# Altium project LetGetThingDone.PrjPcb
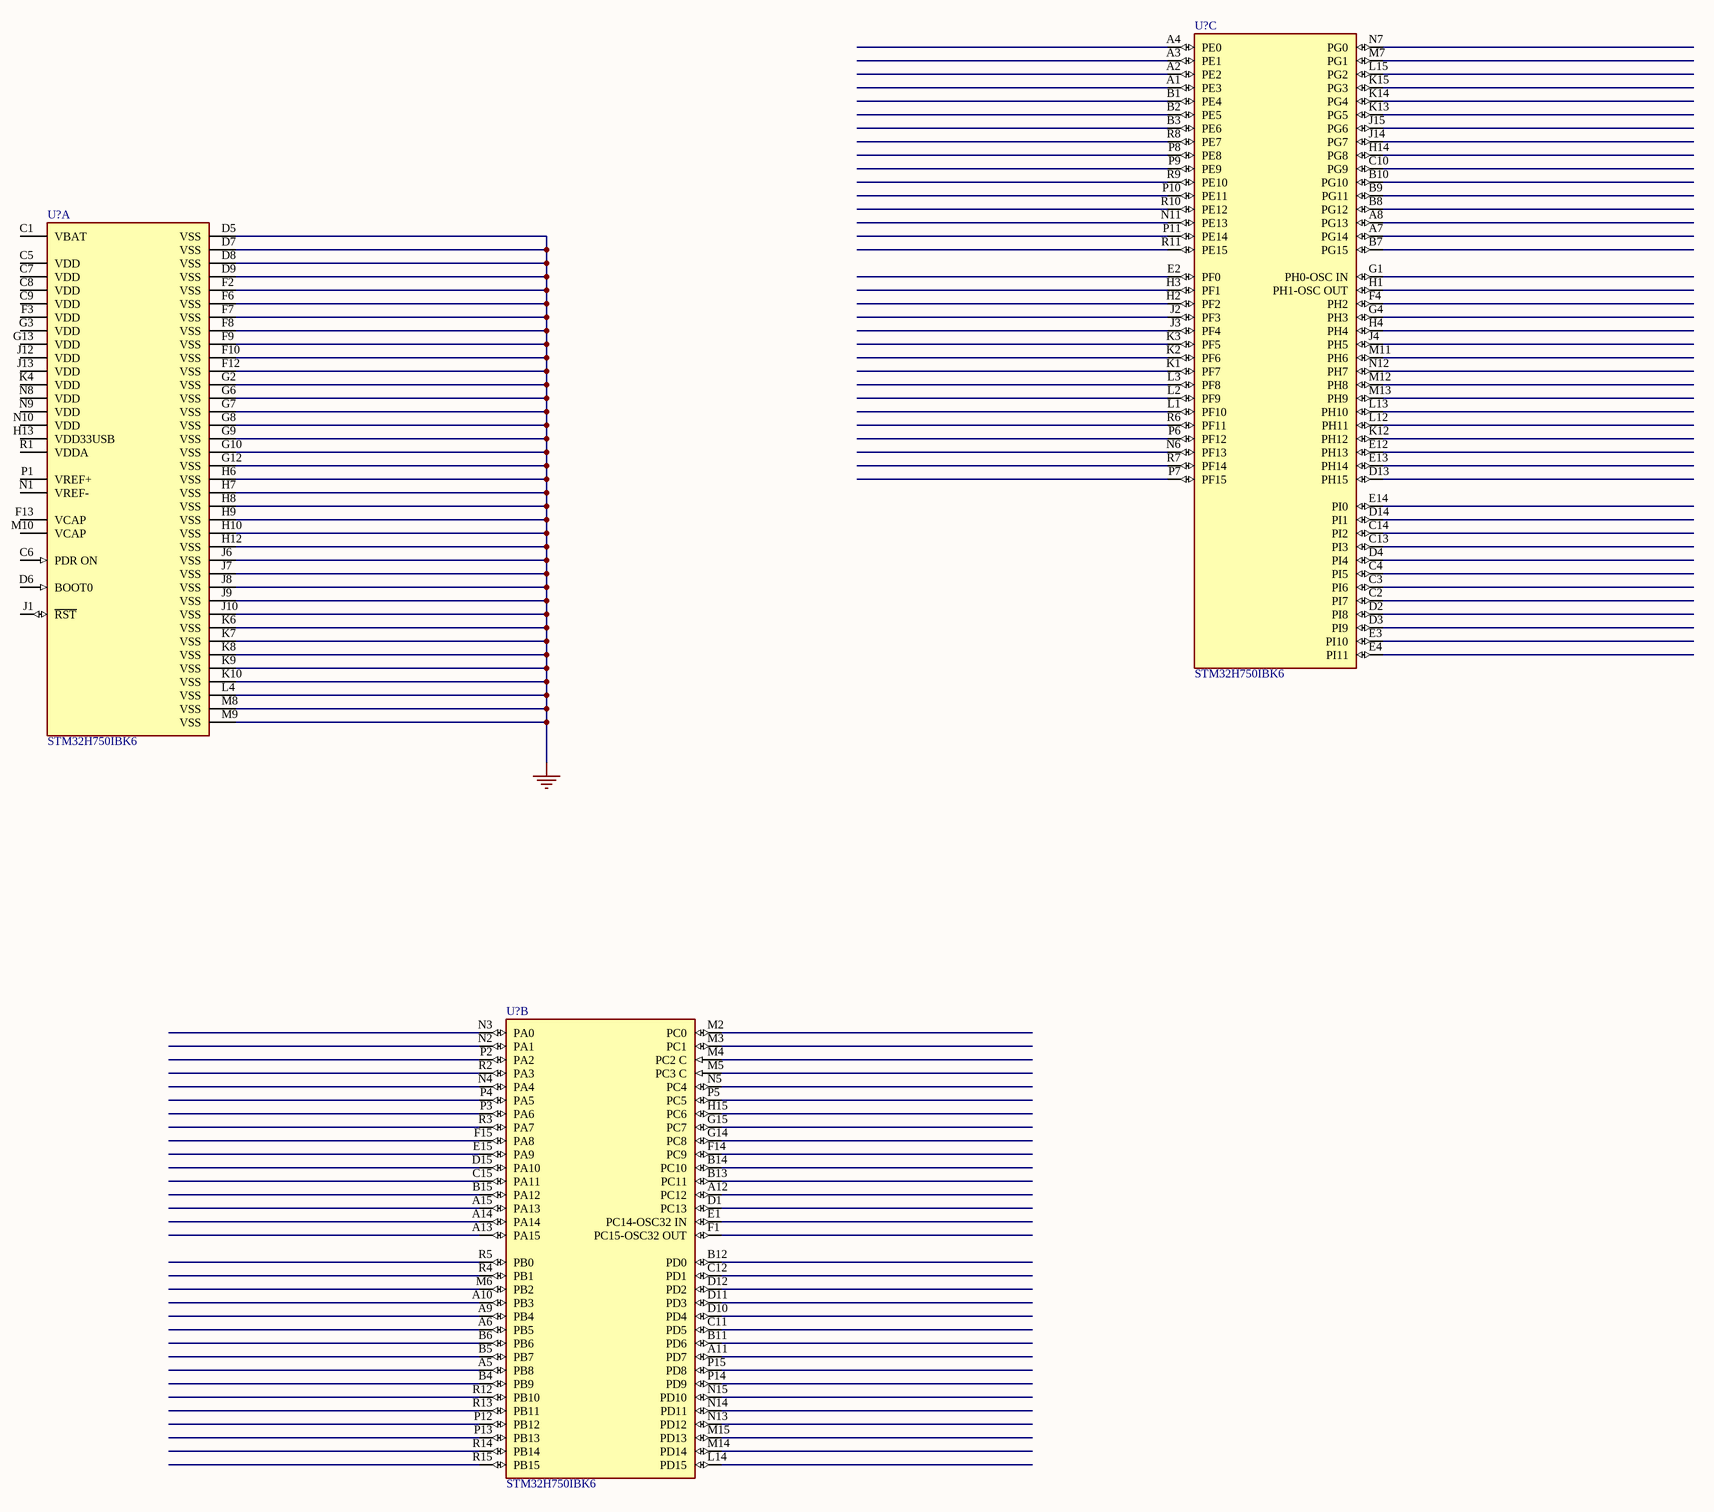
[diagram p0: Sheet2.SchDoc]
1 sheet, 3 parts. Net scope: global (net labels, ports and power ports of the same name join across sheets).

## Sheet Sheet2.SchDoc
size A2; SheetNumber: 1; SheetTotal: 1

### Parts
(Parts that share a designator on the sheet are numbered #1, #2 ... from top to bottom, then left to right.)
U?#1  STM32H750IBK6  [FP-UFBGA176+25-A0E7-MFG]  (part C of 3)
U?#2  STM32H750IBK6  [FP-UFBGA176+25-A0E7-MFG]  (part A of 3)
U?#3  STM32H750IBK6  [FP-UFBGA176+25-A0E7-MFG]  (part B of 3)

### Nets
GND: U?#2.D5(VSS) U?#2.D7(VSS) U?#2.D8(VSS) U?#2.D9(VSS) U?#2.F2(VSS) U?#2.F6(VSS) U?#2.F7(VSS) U?#2.F8(VSS) U?#2.F9(VSS) U?#2.F10(VSS) U?#2.F12(VSS) U?#2.G2(VSS) U?#2.G6(VSS) U?#2.G7(VSS) U?#2.G8(VSS) U?#2.G9(VSS) U?#2.G10(VSS) U?#2.G12(VSS) U?#2.H6(VSS) U?#2.H7(VSS) U?#2.H8(VSS) U?#2.H9(VSS) U?#2.H10(VSS) U?#2.H12(VSS) U?#2.J6(VSS) U?#2.J7(VSS) U?#2.J8(VSS) U?#2.J9(VSS) U?#2.J10(VSS) U?#2.K6(VSS) U?#2.K7(VSS) U?#2.K8(VSS) U?#2.K9(VSS) U?#2.K10(VSS) U?#2.L4(VSS) U?#2.M8(VSS) U?#2.M9(VSS)

Not connected (* = marked no-connect by the designer): U?#1 A1(PE3) A2(PE2) A3(PE1) A4(PE0) A7(PG14) A8(PG13) B1(PE4) B2(PE5) B3(PE6) B7(PG15) B8(PG12) B9(PG11) B10(PG10) C2(PI7) C3(PI6) C4(PI5) C10(PG9) C13(PI3) C14(PI2) D2(PI8) D3(PI9) D4(PI4) D13(PH15) D14(PI1) E2(PF0) E3(PI10) E4(PI11) E12(PH13) E13(PH14) E14(PI0) F4(PH2) G1(PH0-OSC_IN) G4(PH3) H1(PH1-OSC_OUT) H2(PF2) H3(PF1) H4(PH4) H14(PG8) J2(PF3) J3(PF4) J4(PH5) J14(PG7) J15(PG6) K1(PF7) K2(PF6) K3(PF5) K12(PH12) K13(PG5) K14(PG4) K15(PG3) L1(PF10) L2(PF9) L3(PF8) L12(PH11) L13(PH10) L15(PG2) M7(PG1) M11(PH6) M12(PH8) M13(PH9) N6(PF13) N7(PG0) N11(PE13) N12(PH7) P6(PF12) P7(PF15) P8(PE8) P9(PE9) P10(PE11) P11(PE14) R6(PF11) R7(PF14) R8(PE7) R9(PE10) R10(PE12) R11(PE15); U?#2 C1(VBAT) C5(VDD) C6(PDR_ON) C7(VDD) C8(VDD) C9(VDD) D6(BOOT0) F3(VDD) F13(VCAP) G3(VDD) G13(VDD) H13(VDD33USB) J1(~{RST}) J12(VDD) J13(VDD) K4(VDD) M10(VCAP) N1(VREF-) N8(VDD) N9(VDD) N10(VDD) P1(VREF+) R1(VDDA); U?#3 A5(PB8) A6(PB5) A9(PB4) A10(PB3) A11(PD7) A12(PC12) A13(PA15) A14(PA14) A15(PA13) B4(PB9) B5(PB7) B6(PB6) B11(PD6) B12(PD0) B13(PC11) B14(PC10) B15(PA12) C11(PD5) C12(PD1) C15(PA11) D1(PC13) D10(PD4) D11(PD3) D12(PD2) D15(PA10) E1(PC14-OSC32_IN) E15(PA9) F1(PC15-OSC32_OUT) F14(PC9) F15(PA8) G14(PC8) G15(PC7) H15(PC6) L14(PD15) M2(PC0) M3(PC1) M4(PC2_C) M5(PC3_C) M6(PB2) M14(PD14) M15(PD13) N2(PA1) N3(PA0) N4(PA4) N5(PC4) N13(PD12) N14(PD11) N15(PD10) P2(PA2) P3(PA6) P4(PA5) P5(PC5) P12(PB12) P13(PB13) P14(PD9) P15(PD8) R2(PA3) R3(PA7) R4(PB1) R5(PB0) R12(PB10) R13(PB11) R14(PB14) R15(PB15)

### Library data of the parts
U?#1-U?#3 = CMP-12105-000026-1: IC MCU 32BIT 128KB FLASH 176UBGA; Manufacturer: STMicroelectronics; Core Architecture: ARM Cortex-M7; Frequency: 480MHz; Memory Size: 128KBytes; Ram Size: 1MBytes; Number Of Cores: 1; Number Of Timers/Counters: 20; Max Junction Temp: +125°C; Number Of Uart Channels: 9; Number Of Pwm Channels: 42; Number Of Usb Channels: 2; Number Of I/Os: 140; Interface: I2C,SPI,UART,USART,CAN,USB,LIN,IrDA,Ethernet,I2S,Other; Number Of Spi Channels: 6; Max Supply Voltage: 3.6V; Data Bus Width: 32bits; Number Of A/D Converters: 3; Description: ARM® Cortex®-M7 STM32H7 Microcontroller IC 32-Bit 400MHz 128KB (128K x 8) FLASH 176+25UFBGA (10x10); Number Of Adc Channels: 36; Number Of I2C Channels: 4; Min Supply Voltage: 1.62V; Mouser Description: MCU 32-Bit STM32H750IB ARM Cortex M7 RISC 128KB Flash 1.8V/2.5V/3.3V 176-Pin UFBGA Tray; Automotive: No; Manufacturer Part Number: STM32H750IBK6; Ambient Temperature Range High: +85°C; Category: IC; Temperature Range High: +125°C; ComponentLink2Description: Datasheet; Lead Free: Yes; Device Class L2: Embedded Processors and Controllers; Temperature: -40°C to +125°C; Ambient Temperature Range Low: -40°C; Digikey Description: IC MCU 32BIT 128KB FLASH 176UBGA; Height: 0.6mm; Memory Type: FLASH; Octopart: https://octopart.com/stm32h750ibk6-stmicroelectronics-94048546; ComponentLink2URL: https://www.st.com/resource/en/datasheet/stm32h750vb.pdf; Ipc Land Pattern Name: BGA225N65P15X15_1015X1015X60; Device Class L3: Microcontrollers; RoHS: TRUE; Package: UFBGA176+25-A0E7; Device Class L1: Integrated Circuits (ICs); Number Of Ethernet Channels: 1; Temperature Range Low: -40°C